# EasyEDA schematic MCPICKUP.json
TITLE: Sheet_1; REV: 1.0; Date: 2023-10-18; Sheet: 1/1; Company: Your Company
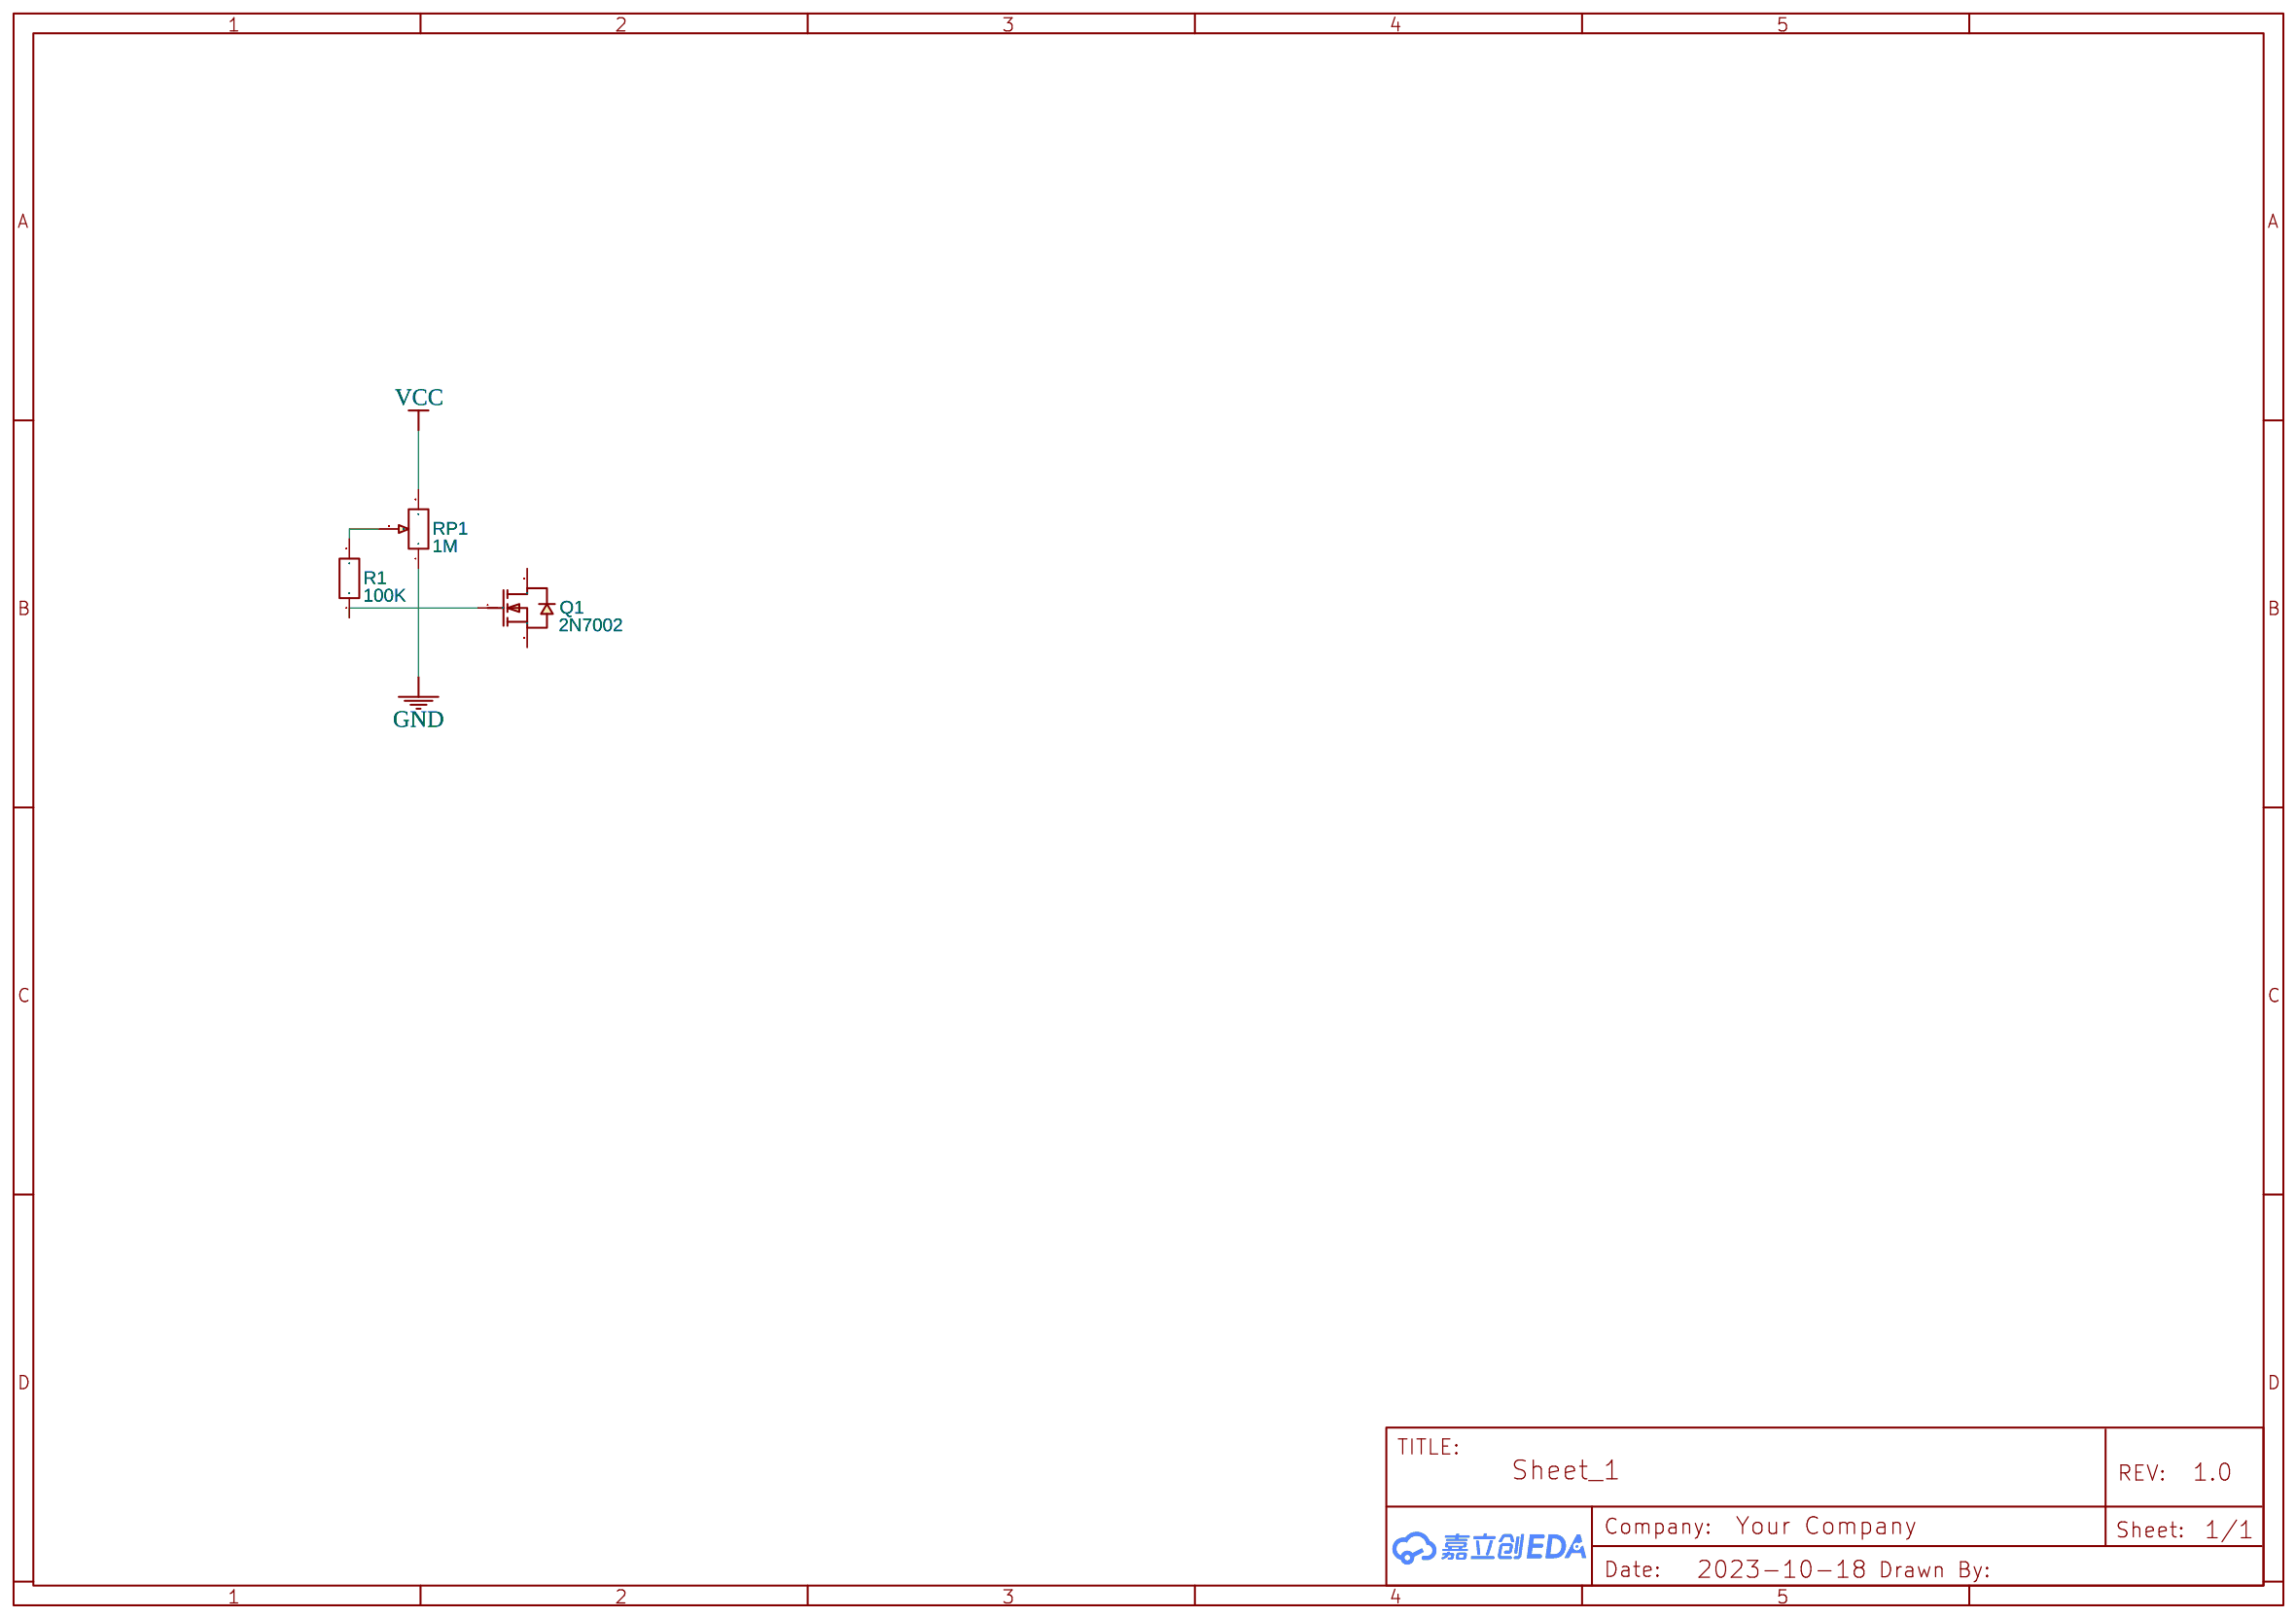
[diagram p0: schematic sheet]

## Parts
Q1  2N7002  [SOT-23_L2.9-W1.3-P0.95-LS2.4-BR]
R1  100K  [R0603]
RP1  1M  [RES-ADJ-TH_3296W]

## Library data of the parts
Q1 = 2N7002: Supplier: LCSC; Manufacturer: Nexperia; Manufacturer Part: 2N7002,215; image: //image.lceda.cn/szlcsc/C65189.jpg; Supplier Part: C65189; Paste Type: expand; Contributor: LCEDA_Lib
R1 = R_0603_EU: Contributor: LCEDA_Lib
RP1 = R_3296W_EU: Supplier: LCSC; Contributor: LCEDA_Lib; Value(Ω): 10k

## Nets
GND: RP1.1
VCC: RP1.3
Net-(Q1-1): Q1.1(G) R1.1
Net-(R1-2): R1.2 RP1.2

Not connected (* = marked no-connect by the designer): Q1 2(S) 3(D)
